# EAGLE board mainboard (EAGLE 4.13), part 1 of 2
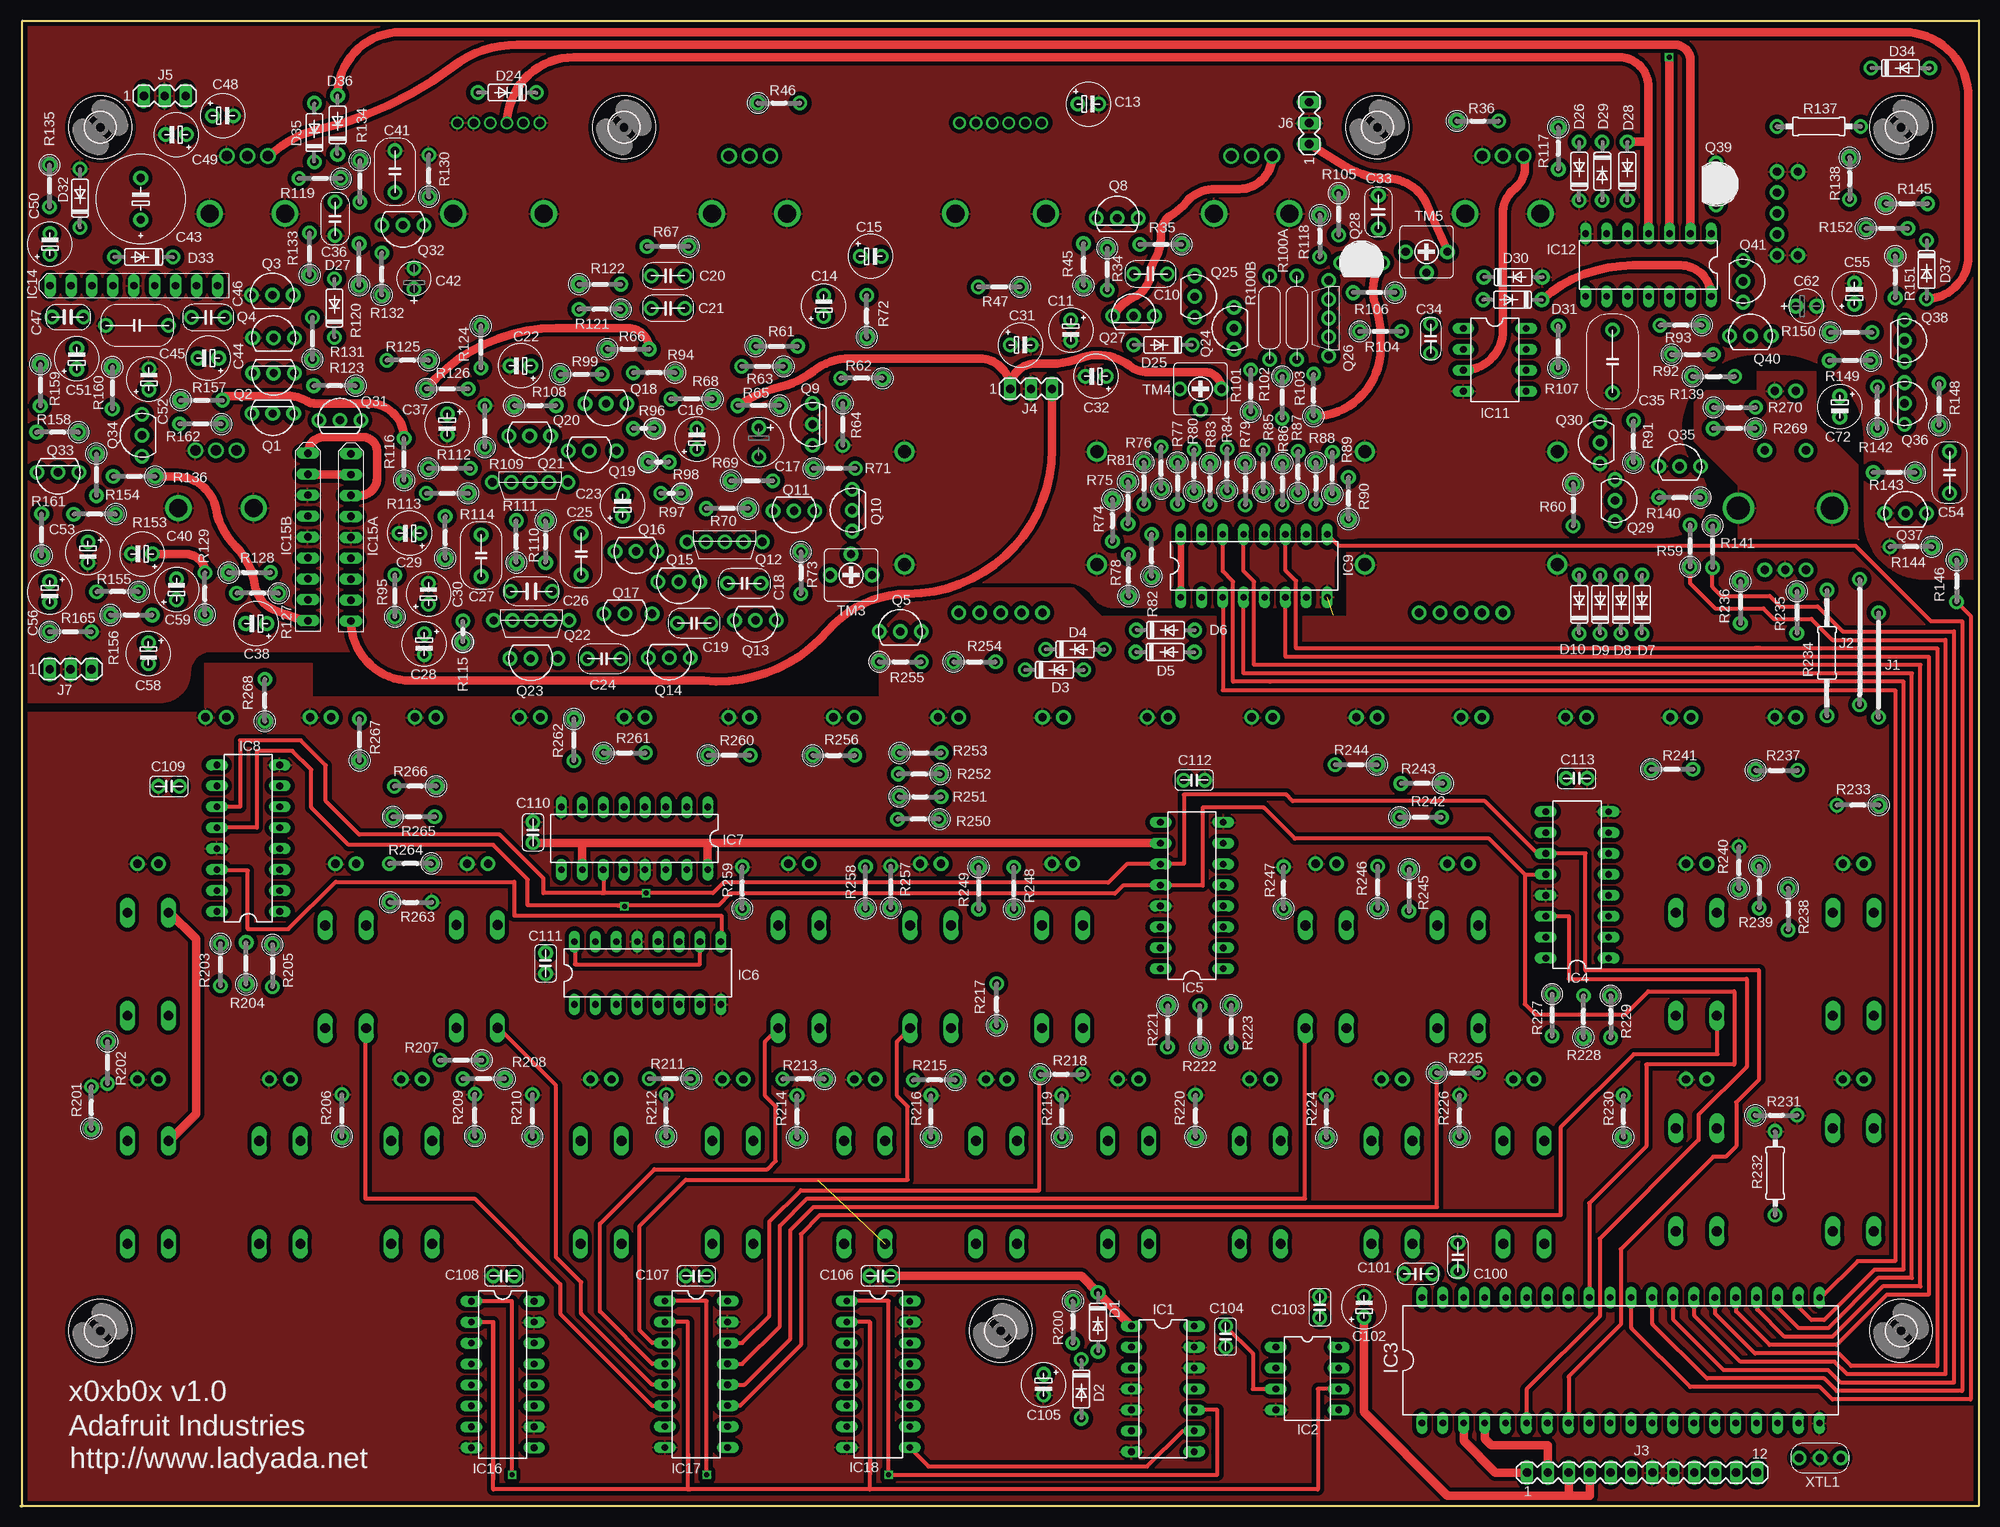
[diagram p2: board, top side]
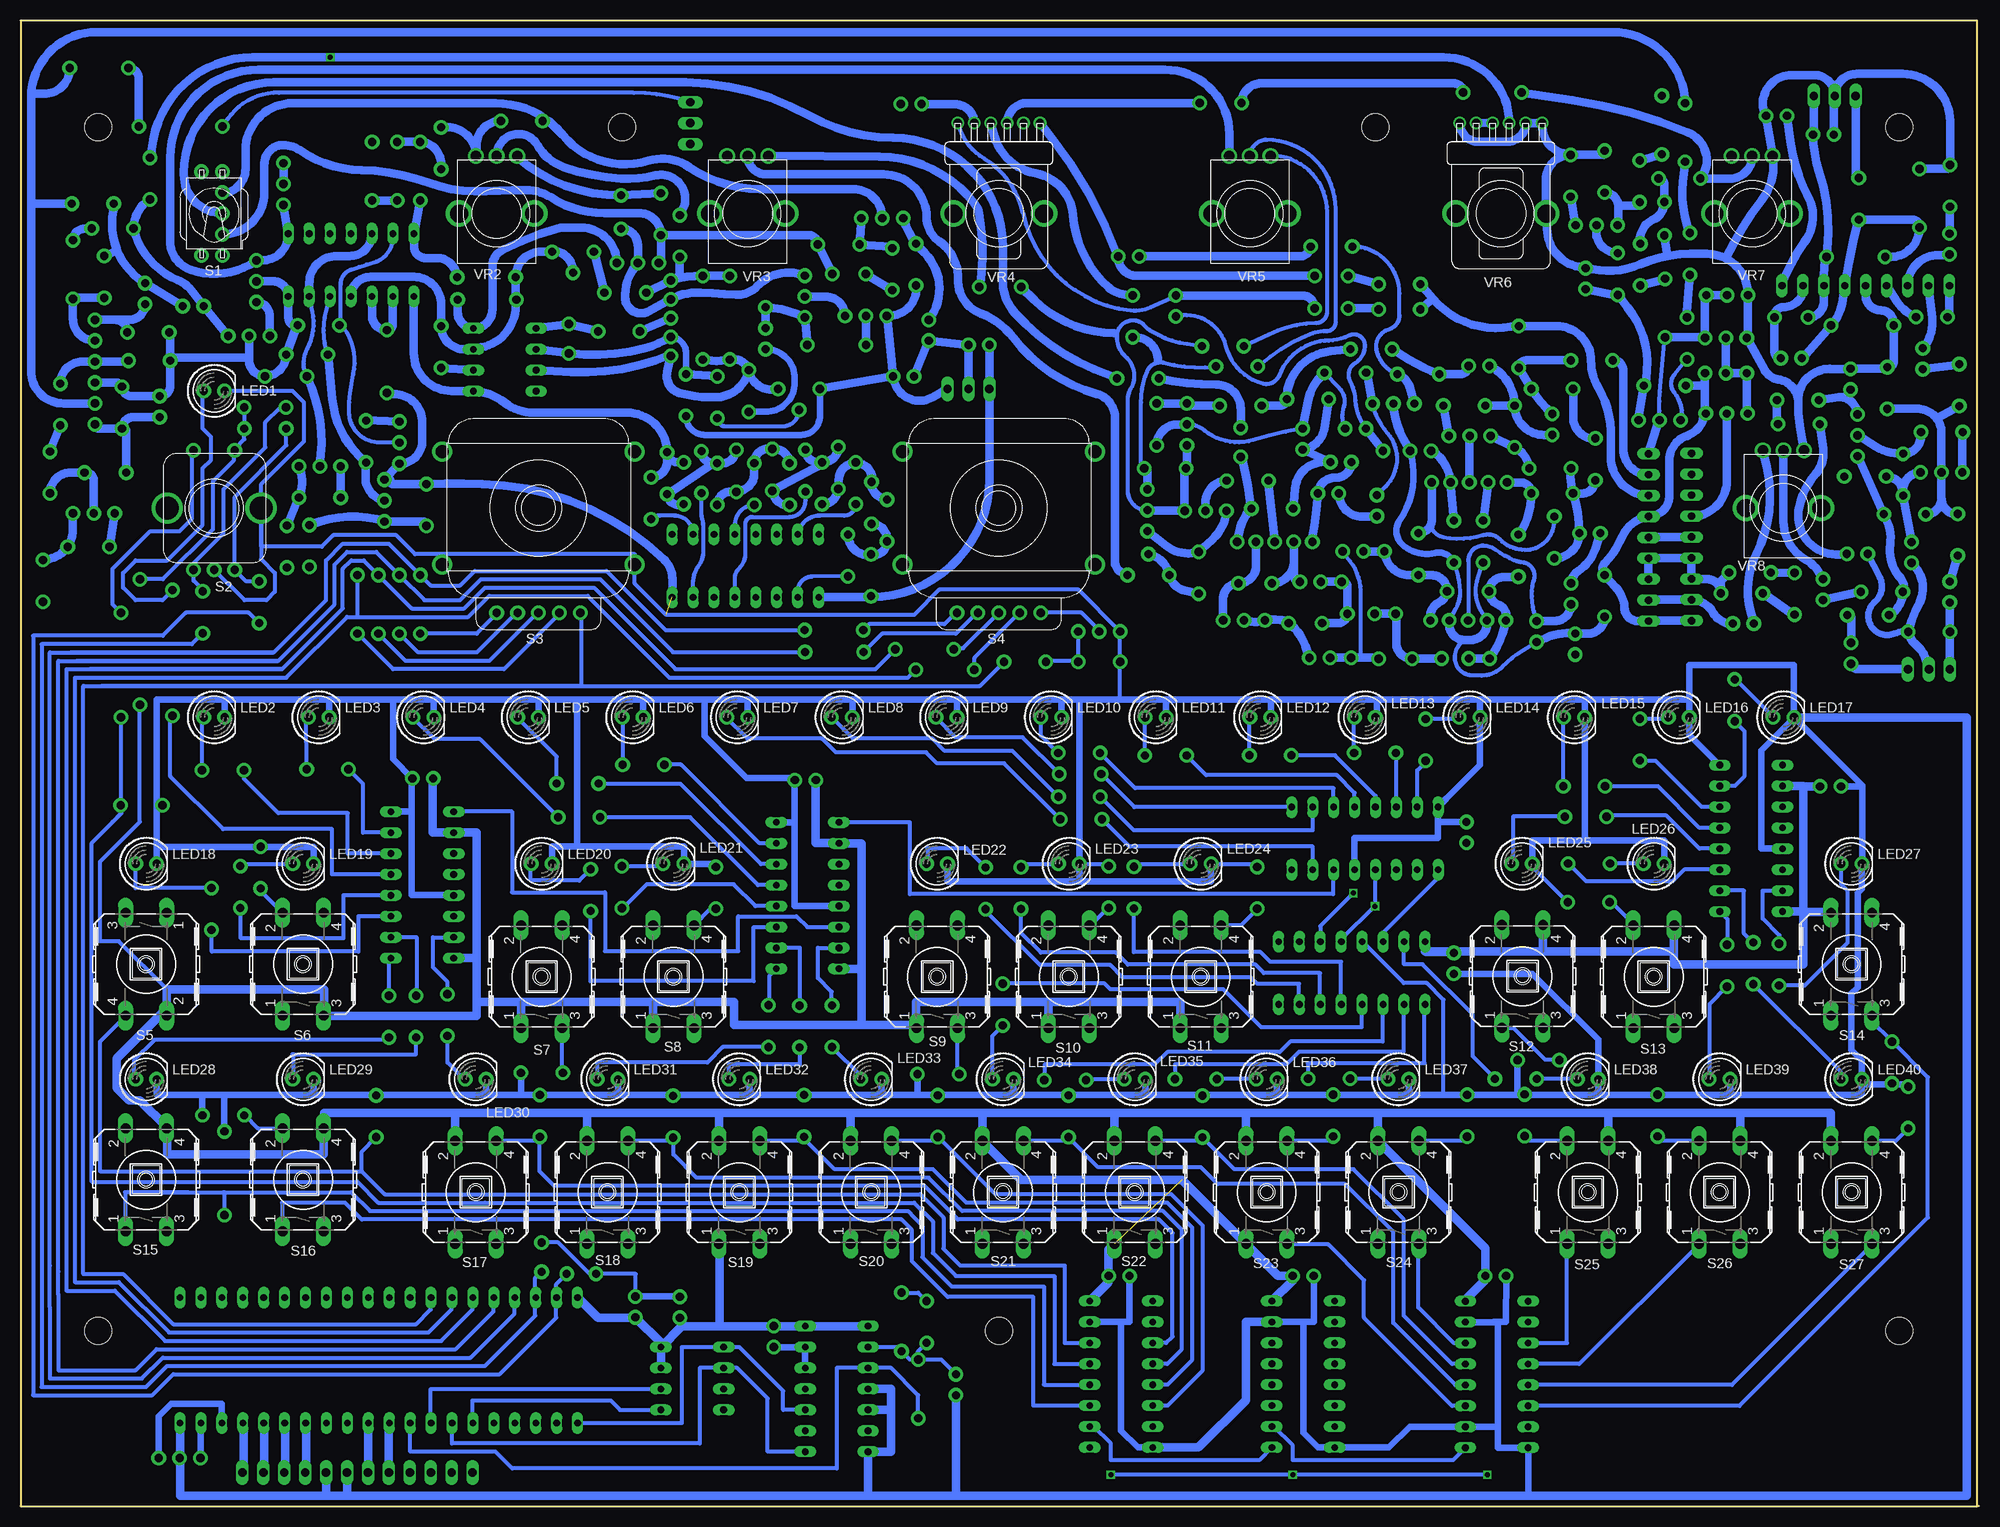
[diagram p3: board, bottom side, seen from below]

Size 237.72 x 180.34 mm. Coordinates in mm from the lower left corner, seen from the top.
Outline: 0.23,0 0.23,180.34 237.72,180.34 237.72,0 0.2,0
Outline: 0,0 0.2,0
Outline: 0.2,0 0.2,0.18
Copper layers (1*16): Top 0.035mm / dielectric 1.5mm / Bottom 0.035mm
Design rules "default": minimum track width 10mil, minimum drill 20mil, track to track 10mil, track to pad 10mil, pad to pad 10mil, via to via 10mil, smd to smd 10mil, copper to edge 10mil, drill to drill 10mil, minimum pad ring 10mil, minimum via ring 8mil, stop-mask expansion 4mil, vias tented up to drill 0mil, thermal gap 10mil

## Footprints (pad centres in the part's own frame; a part is rotated, then mirrored left to right if it is on the bottom)
C050-024X044 = drill 1 pad 1.778 round: 1 -2.032,0; 2 2.032,0
E5-6 = drill 1 pad 1.778 round: + -1.27,0; - 1.27,0
E3,5-8 = drill 1 pad 1.778 round: + -1.778,0; - 1.778,0
C050-025X075 = drill 1 pad 1.778 round: 1 -2.032,0; 2 2.032,0
C050-030X075 = drill 1 pad 1.778 round: 1 -2.54,0; 2 2.54,0
C075-032X103 = drill 1 pad 1.778 round: 1 -2.54,0; 2 2.54,0
C050-035X075 = drill 1 pad 1.778 round: 1 -1.778,0; 2 1.778,0
C050-045X075 = drill 1 pad 1.778 round: 1 -3.81,0; 2 3.81,0
E2,5-7 = drill 1 pad 1.778 round: + -1.27,0; - 1.27,0
E5-5 = drill 1 pad 1.778 round: + -2.54,0; - 2.54,0
C050-050X075 = drill 1 pad 1.778 round: 1 -3.81,0; 2 3.81,0
C050-075X075 = drill 1 pad 1.778 round: 1 -1.905,0; 2 1.905,0
C050-055X075 = drill 1 pad 1.778 round: 1 -2.54,0; 2 2.54,0
C050H075X075 = drill 1 pad 1.778 round: 1 -1.27,0; 2 1.27,0
DO35-10 = drill 1 pad 1.778 round: A 3.556,0; C -3.556,0
DIL14 = drill 0.813 long: 1 -7.62,-3.81; 2 -5.08,-3.81; 3 -2.54,-3.81; 4 0,-3.81; 5 2.54,-3.81; 6 5.08,-3.81; 7 7.62,-3.81; 8 7.62,3.81; 9 5.08,3.81; 10 2.54,3.81; 11 0,3.81; 12 -2.54,3.81; 13 -5.08,3.81; 14 -7.62,3.81
DIL08 = drill 0.813 long: 1 -3.81,-3.81; 2 -1.27,-3.81; 3 1.27,-3.81; 4 3.81,-3.81; 5 3.81,3.81; 6 1.27,3.81; 7 -1.27,3.81; 8 -3.81,3.81
DIL40 = drill 0.813 long: 1 -24.13,-7.62; 2 -21.59,-7.62; 3 -19.05,-7.62; 4 -16.51,-7.62; 5 -13.97,-7.62; 6 -11.43,-7.62; 7 -8.89,-7.62; 8 -6.35,-7.62; 9 -3.81,-7.62; 10 -1.27,-7.62; 11 1.27,-7.62; 12 3.81,-7.62; 13 6.35,-7.62; 14 8.89,-7.62; 15 11.43,-7.62; 16 13.97,-7.62; 17 16.51,-7.62; 18 19.05,-7.62; 19 21.59,-7.62; 20 24.13,-7.62; 21 24.13,7.62; 22 21.59,7.62; 23 19.05,7.62; 24 16.51,7.62; 25 13.97,7.62; 26 11.43,7.62; 27 8.89,7.62; 28 6.35,7.62; 29 3.81,7.62; 30 1.27,7.62; 31 -1.27,7.62; 32 -3.81,7.62; 33 -6.35,7.62; 34 -8.89,7.62; 35 -11.43,7.62; 36 -13.97,7.62; 37 -16.51,7.62; 38 -19.05,7.62; 39 -21.59,7.62; 40 -24.13,7.62
DIL16 = drill 0.813 long: 1 -8.89,-3.81; 2 -6.35,-3.81; 3 -3.81,-3.81; 4 -1.27,-3.81; 5 1.27,-3.81; 6 3.81,-3.81; 7 6.35,-3.81; 8 8.89,-3.81; 9 8.89,3.81; 10 6.35,3.81; 11 3.81,3.81; 12 1.27,3.81; 13 -1.27,3.81; 14 -3.81,3.81; 15 -6.35,3.81; 16 -8.89,3.81
SIP9 = drill 0.9 pad 1.016 long: 1 -10.16,0; 2 -7.62,0; 3 -5.08,0; 4 -2.54,0; 5 0,0; 6 2.54,0; 7 5.08,0; 8 7.62,0; 9 10.16,0
12 = drill 1 pad 1.778 round: 1 -6.35,0; 2 6.35,0
15 = drill 1 pad 1.778 round: 1 -7.62,0; 2 7.62,0
MA12-1 = drill 1.016 long: 1 -13.97,0; 2 -11.43,0; 3 -8.89,0; 4 -6.35,0; 5 -3.81,0; 6 -1.27,0; 7 1.27,0; 8 3.81,0; 9 6.35,0; 10 8.89,0; 11 11.43,0; 12 13.97,0
MA03-1 = drill 1.016 long: 1 -2.54,0; 2 0,0; 3 2.54,0
LED5MM = drill 1 pad 1.778 round: A -1.27,0; K 1.27,0
TO92 = drill 1 pad 1.778 round: 1 2.54,0; 2 0,0; 3 -2.54,0
2SC536F = drill 1 pad 1.778 round: 1 2.54,0; 2 0,0; 3 -2.54,0
SSIP5 = drill 1 pad 1.778 round: 1 -4.572,0; 2 -2.286,0; 3 0,0; 4 2.286,0; 5 4.572,0
2SC536_UNEVEN = drill 1 pad 1.778 round: 1 2.54,0; 2 0,0; 3 -3.302,0
2SK30 = drill 1 pad 1.778 round: 1 2.54,0; 2 0,0; 3 -2.54,0
0207/5V = drill 1 pad 1.778 round: 1 -2.54,0; 2 2.54,0
0207/2V = drill 1 pad 1.778 round: 1 -1.27,0; 2 1.27,0
R-7,5 = drill 1 pad 1.778 round: 1 -5.08,0; 2 5.08,0
0207/10 = drill 1 pad 1.778 round: 1 -5.08,0; 2 5.08,0
0207/15 = drill 1 pad 1.778 round: 1 -7.62,0; 2 7.62,0
NKKTOGGLE = drill 1 pad 1.778 round: 1 -1.016,2.54; 2 -1.016,0; 3 -1.016,-2.54; M1 -1.016,-5.08; M2 1.524,-5.08; M3 1.524,5.08; M4 -1.016,5.08
PEC11-S = drill 1 pad 1.778 round: A -2.5,-7.5; B 2.5,-7.5; C 0,-7.5; SW1 -2.5,7; SW2 2.5,7 | drill 2.8 round: P$1 5.7,0; P$2 -5.7,0
GH3074 = drill 1 pad 1.778 round: C 5.08,-12.7; P$1 2.54,-12.7; P$2 0,-12.7; P$4 -2.54,-12.7; P$8 -5.08,-12.7 | drill 1.6 round: MT1 -11.684,6.858; MT2 -11.684,-6.858; MT3 11.684,-6.858; MT4 11.684,6.858
B3F-40XX = drill 1.194 long: 1 -6.248,2.489; 2 6.248,2.489; 3 -6.248,-2.489; 4 6.248,-2.489
306 = drill 1 pad 1.778 round: 1 -2.54,0; 2 0,-2.54; 3 2.54,0
1,3 = hole 3.302: 0,0
EVU = drill 1.27 round: 1 -2.5,-7; 2 0,-7; 3 2.5,-7 | drill 2.184 round: M1 -4.572,0; M2 4.572,0
ALPHADUAL = drill 1.016 round: 1A -3,-11; 1B -1,-11; 2A -5,-11; 2B 1,-11; 3A 5,-11; 3B 3,-11 | drill 2.184 round: M1 -5.5,0; M2 5.5,0
2SC2021 = drill 1 pad 1.778 round: 1 -2.54,0; 2 0,0; 3 2.54,0

## Placement (x,y rotation side)
C10  .01  [C050-024X044]  137.16,149.58 180 top
C11  1/50  [E5-6]  127.48,142.75 270 top
C13  1/50  [E5-6]  129.62,170.21 0 top
C14  1/50  [E5-6]  97.49,145.69 90 top
C15  1/50  [E5-6]  103.2,151.71 0 top
C16  10/16  [E5-6]  82.09,129.54 90 top
C17  1/50  [E3,5-8]  89.61,129.16 270 top
C18  .018  [C050-025X075]  87.86,112.01 0 top
C19  .033  [C050-025X075]  81.76,107.19 180 top
C20  .01  [C050-024X044]  78.59,149.35 0 top
C21  .01  [C050-024X044]  78.59,145.41 0 top
C22  1/50  [E5-6]  60.68,138.43 180 top
C23  1/50  [E5-6]  73.08,121.46 90 top
C24  .033  [C050-025X075]  70.84,102.87 180 top
C25  .1  [C050-030X075]  68.05,115.57 90 top
C26  .033  [C075-032X103]  62,111.05 180 top
C27  .1  [C050-030X075]  55.91,115.39 90 top
C28  47/16  [E5-6]  49,104.65 270 top
C29  1/50  [E5-6]  47.22,118.11 180 top
C30  10/16  [E5-6]  49.5,110.74 90 top
C31  10/16  [E5-6]  121.39,140.97 0 top
C32  10/16  [E5-6]  130.53,137.16 180 top
C33  .01  [C050-024X044]  164.82,157.1 90 top
C34  .001  [C050-035X075]  171.17,141.73 270 top
C35  .22  [C050-045X075]  193.24,138.96 270 top
C36  .033  [C050-025X075]  38.18,156.29 270 top
C37  10/16  [E5-6]  51.79,131.32 270 top
C38  1/50  [E5-6]  28.6,107.14 180 top
C40  10/16  [E5-6]  14.76,115.6 180 top
C41  .1  [C050-030X075]  45.44,162 90 top
C42  1/35  [E2,5-7]  47.75,149.02 90 top
C43  1000/6.3  [E5-5]  14.58,158.7 90 top
C44  47/16  [E5-6]  22.78,139.37 180 top
C45  .068  [C050-050X075]  14.15,143.33 180 top
C46  .01  [C050-024X044]  22.78,144.3 0 top
C47  .0068  [C050-075X075]  5.71,144.35 180 top
C48  100/6.3  [E5-6]  24.56,168.78 0 top
C49  100/6.3  [E5-6]  18.87,166.5 180 top
C50  10/16  [E5-6]  3.56,153.21 90 top
C51  2.2/50  [E5-6]  6.81,139.29 90 top
C52  10/16  [E5-6]  15.57,136.8 90 top
C53  47/16  [E5-6]  8.18,115.77 270 top
C54  .047  [C050-055X075]  234.16,125.48 270 top
C55  47/16  [E5-6]  222.61,147.19 90 top
C56  1/50  [E5-6]  3.53,110.97 270 top
C58  1/50  [E5-6]  15.52,103.53 270 top
C59  1/50  [E5-6]  18.92,111.28 90 top
C62  1/35  [E2,5-7]  216.76,145.67 0 top
C72  10/16  [E5-6]  220.83,133.48 270 top
C100  .001  [C050-035X075]  174.47,30.23 270 top
C101  .001  [C050-035X075]  169.65,28.19 0 top
C102  100/10  [E5-6]  163.09,24.18 90 top
C103  .1  [C050H075X075]  157.71,24.13 90 top
C104  .1  [C050H075X075]  146.28,20.57 90 top
C105  1/50  [E5-6]  124.18,14.73 270 top
C106  .1  [C050H075X075]  104.37,27.94 0 top
C107  .1  [C050H075X075]  82.02,27.94 0 top
C108  .1  [C050H075X075]  58.65,27.94 0 top
C109  .1  [C050H075X075]  18.01,87.38 0 top
C110  .1  [C050H075X075]  62.2,81.79 270 top
C111  .1  [C050H075X075]  63.73,65.89 90 top
C112  .1  [C050H075X075]  142.47,88.14 180 top
C113  .1  [C050H075X075]  188.9,88.34 180 top
D1  1N4148  [DO35-10]  130.78,22.35 270 top
D2  1N4148  [DO35-10]  128.75,14.22 270 top
D3  1N4148  [DO35-10]  125.5,101.52 0 top
D4  1N4148  [DO35-10]  127.99,104.01 0 top
D5  1N4148  [DO35-10]  138.94,103.68 0 top
D6  1N4148  [DO35-10]  138.99,106.35 0 top
D7  1N4148  [DO35-10]  196.82,109.47 90 top
D8  1N4148  [DO35-10]  194.28,109.47 90 top
D9  1N4148  [DO35-10]  191.74,109.47 90 top
D10  1N4148  [DO35-10]  189.2,109.47 90 top
D24  1N4148  [DO35-10]  59.05,171.6 180 top
D25  1N4148  [DO35-10]  138.66,140.97 180 top
D26  1N4148  [DO35-10]  189.2,162.05 90 top
D27  1N4148  [DO35-10]  38.1,145.44 90 top
D28  1N4148  [DO35-10]  195.05,162.05 90 top
D29  1N4148  [DO35-10]  192,162.05 270 top
D30  1N4148  [DO35-10]  181.18,149.2 0 top
D31  1N4148  [DO35-10]  181.1,146.46 180 top
D32  1N4148  [DO35-10]  7.21,158.78 90 top
D33  1N4148  [DO35-10]  14.94,151.64 180 top
D34  1N4148  [DO35-10]  228.19,174.57 0 top
D35  1N4148  [DO35-10]  35.66,166.75 90 top
D36  1N4148  [DO35-10]  38.48,167.67 90 top
D37  1N4148  [DO35-10]  231.37,150.11 270 top
IC1  74126N  [DIL14]  138.66,14.22 270 top
IC2  AT25P  [DIL08]  156.18,15.49 270 top
IC3  MEGA162P  [DIL40]  194.23,17.7 0 top
IC4  74HC595N  [DIL16]  188.95,75.41 90 top
IC5  74HC595N  [DIL16]  142.19,74.12 90 top
IC6  74HC595N  [DIL16]  76.12,64.72 0 top
IC7  74HC595N  [DIL16]  74.52,81.05 180 top
IC8  74HC595N  [DIL16]  27.64,81.08 90 top
IC9  4174P  [DIL16]  149.73,114.15 0 top
IC11  [DIL08]  178.94,139.17 270 top
IC12  4066N  [DIL14]  197.61,150.67 180 top
IC14  LA44140  [SIP9]  13.74,148.16 0 top
IC15A  [SIP9]  40.11,117.6 270 top
IC15B  BA6110  [SIP9]  34.87,117.65 270 top
IC16  74HC165N  [DIL16]  58.52,15.98 270 top
IC17  74HC165N  [DIL16]  82.02,16 270 top
IC18  74HC165N  [DIL16]  104.11,16 270 top
J1  J12MM  [12]  225.53,102.11 270 top
J2  J15MM  [15]  223.24,104.9 270 top
J3  [MA12-1]  196.82,4.06 0 top
J4  [MA03-1]  122.66,135.64 0 top
J5  [MA03-1]  17.5,171.2 0 top
J6  [MA03-1]  156.44,167.89 90 top
J7  [MA03-1]  6.07,101.6 0 top
LED1  [LED5MM]  214.22,135.38 0 bottom
LED2  [LED5MM]  214.22,95.76 0 bottom
LED3  [LED5MM]  201.52,95.76 0 bottom
LED4  [LED5MM]  188.82,95.76 0 bottom
LED5  [LED5MM]  176.12,95.76 0 bottom
LED6  [LED5MM]  163.42,95.76 0 bottom
LED7  [LED5MM]  150.72,95.76 0 bottom
LED8  [LED5MM]  138.02,95.76 0 bottom
LED9  [LED5MM]  125.32,95.76 0 bottom
LED10  [LED5MM]  112.62,95.76 0 bottom
LED11  [LED5MM]  99.92,95.76 0 bottom
LED12  [LED5MM]  87.22,95.76 0 bottom
LED13  [LED5MM]  74.52,95.76 0 bottom
LED14  [LED5MM]  61.82,95.76 0 bottom
LED15  [LED5MM]  49.12,95.76 0 bottom
LED16  [LED5MM]  36.42,95.76 0 bottom
LED17  [LED5MM]  23.72,95.76 0 bottom
LED18  [LED5MM]  222.48,77.98 0 bottom
LED19  [LED5MM]  203.43,77.98 0 bottom
LED20  [LED5MM]  174.47,77.98 0 bottom
LED21  [LED5MM]  158.47,77.98 0 bottom
LED22  [LED5MM]  126.47,77.98 0 bottom
LED23  [LED5MM]  110.46,77.98 0 bottom
LED24  [LED5MM]  94.46,77.98 0 bottom
LED25  [LED5MM]  55.47,77.98 0 bottom
LED26  [LED5MM]  39.47,77.98 0 bottom
LED27  [LED5MM]  15.47,77.98 0 bottom
LED28  [LED5MM]  222.48,51.82 0 bottom
LED29  [LED5MM]  203.43,51.82 0 bottom
LED30  [LED5MM]  182.47,51.82 0 bottom
LED31  [LED5MM]  166.47,51.82 0 bottom
LED32  [LED5MM]  150.47,51.82 0 bottom
LED33  [LED5MM]  134.47,51.82 0 bottom
LED34  [LED5MM]  118.47,51.82 0 bottom
LED35  [LED5MM]  102.46,51.82 0 bottom
LED36  [LED5MM]  86.46,51.82 0 bottom
LED37  [LED5MM]  70.46,51.82 0 bottom
LED38  [LED5MM]  47.47,51.82 0 bottom
LED39  [LED5MM]  31.47,51.82 0 bottom
LED40  [LED5MM]  15.47,51.82 0 bottom
Q1  2SA733P  [TO92]  30.61,132.64 180 top
Q2  2SA733P  [TO92]  30.71,137.54 180 top
Q3  2SC536F  [2SC536F]  30.56,147.02 0 top
Q4  2SC536F  [2SC536F]  30.71,141.83 0 top
Q5  2SC536F  [2SC536F]  106.78,106.17 0 top
Q8  2SA733P  [TO92]  133.12,156.36 0 top
Q9  2SA733P  [TO92]  96.14,131.32 90 top
Q10  2SA733P  [TO92]  100.94,120.9 90 top
Q11  2SC536F  [2SC536F]  93.88,120.83 180 top
Q12  2SC1583  [SSIP5]  85.47,117.07 180 top
Q13  2SC536F  [2SC536F]  89.2,107.54 180 top
Q14  2SC536F  [2SC536F]  78.74,102.97 180 top
Q15  2SC536F  [2SC536F]  79.88,112.22 180 top
Q16  2SC536F  [2SC536F]  74.7,115.9 180 top
Q17  2SC536F  [2SC536_UNEVEN]  73.36,108.33 180 top
Q18  2SC536F  [2SC536F]  71.07,133.83 180 top
Q19  2SC536FUNEVEN  [2SC536_UNEVEN]  69.04,128.12 180 top
Q20  2SC536F  [2SC536F]  61.8,129.92 180 top
Q21  2SC1583  [SSIP5]  61.85,124.28 180 top
Q22  2SC2291  [SSIP5]  62,107.52 180 top
Q23  2SC536F  [2SC536_UNEVEN]  61.93,102.9 180 top
Q24  2SC536F  [2SC536F]  147.29,143 90 top
Q25  2SC536F  [2SC536F]  142.52,146.84 270 top
Q26  2SC1583  [SSIP5]  158.8,144.22 90 top
Q27  2SA733P  [TO92]  135.1,144.5 0 top
Q28  2SK30  [2SK30]  162.79,150.93 0 top
Q29  2SC536F  [2SC536F]  193.55,122.07 270 top
Q30  2SC536F  [2SC536F]  191.74,129.11 90 top
Q31  2SA733P  [TO92]  38.76,131.83 0 top
Q32  2SC536F  [2SC536F]  46.41,155.5 180 top
Q33  2SA733P  [TO92]  4.55,125.5 180 top
Q34  2SC536F  [2SC536F]  14.73,130 90 top
Q35  2SC536F  [2SC536F]  201.4,126.24 0 top
Q36  2SA733P  [TO92]  228.7,133.86 270 top
Q37  2SC536F  [2SC536F]  228.83,120.52 0 top
Q38  2SA733P  [TO92]  228.7,141.48 270 top
Q39  2SK30  [2SK30]  205.82,160.5 270 top
Q40  2SC536F  [2SC536F]  209.98,142.06 0 top
Q41  2SC536F  [2SC536F]  209.09,148.69 270 top
R34  10K  [0207/5V]  131.9,150.16 270 top
R35  100K  [0207/5V]  138.4,153.16 180 top
R36  10K  [0207/5V]  176.89,168.15 0 top
R45  22K  [0207/5V]  129.03,150.72 90 top
R46  47K  [0207/5V]  92.05,170.33 0 top
R47  10K  [0207/5V]  118.8,148.01 180 top
R59  100K  [0207/5V]  202.67,116.56 90 top
R60  22K  [0207/5V]  188.47,121.54 270 top
R61  10K  [0207/5V]  91.77,140.82 0 top
R62  220K  [0207/5V]  102.08,136.91 180 top
R63  220K  [0207/5V]  90.07,138.35 180 top
R64  10K  [0207/5V]  99.8,131.32 270 top
R65  10K  [0207/5V]  89.61,133.6 180 top
R66  100K  [0207/5V]  73.76,140.46 0 top
R67  2.2K  [0207/5V]  78.59,152.91 180 top
R68  2.2K  [0207/5V]  81.46,134.39 180 top
R69  2.2K  [0207/5V]  88.77,124.49 0 top
R70  2.2K  [0207/5V]  85.78,121.11 180 top
R71  2.2K  [0207/5V]  98.78,125.98 0 top
R72  100K  [0207/5V]  102.72,144.45 90 top
R73  100K  [0207/5V]  94.72,113.31 270 top
R74  200K  [0207/5V]  132.54,119.66 270 top
R75  200K  [0207/5V]  134.42,121.79 270 top
R76  200K  [0207/5V]  138.46,126.03 90 top
R77  200K  [0207/5V]  140.44,124.18 270 top
R78  200K  [0207/5V]  134.49,113 90 top
R79  200K  [0207/5V]  148.67,124.08 270 top
R80  200K  [0207/5V]  142.44,125.7 90 top
R81  200K  [0207/5V]  136.35,124.18 270 top
R82  200K  [0207/5V]  137.29,115.42 90 top
R83  200K  [0207/5V]  144.37,124.08 270 top
R84  200K  [0207/5V]  146.46,125.81 90 top
R85  200K  [0207/5V]  150.85,125.68 90 top
R86  200K  [0207/5V]  153.16,124.08 270 top
R87  200K  [0207/5V]  155.07,125.53 90 top
R88  200K  [0207/5V]  157.23,124.18 270 top
R89  200K  [0207/5V]  159.23,125.4 90 top
R90  200k  [0207/5V]  161.19,122.35 90 top
R91  1M  [0207/5V]  195.78,129.24 90 top
R92  100K  [0207/5V]  202.95,139.8 0 top
R93  100K  [0207/5V]  201.55,143.36 180 top
R94  10K  [0207/5V]  76.91,137.59 180 top
R95  100  [0207/5V]  45.44,110.49 90 top
R96  10K  [0207/2V]  75.67,130.81 180 top
R97  10K  [0207/2V]  78.97,122.94 180 top
R98  2.2K  [0207/2V]  77.44,126.75 0 top
R99  100K  [0207/5V]  68.05,137.41 0 top
R100A  THERMISTOR-7,5  [R-7,5]  154.91,144.27 270 top
R100B  THERMISTOR-7,5  [R-7,5]  151.61,144.27 90 top
R101  10K  [0207/5V]  149.33,135.38 90 top
R102  100K  [0207/5V]  153.14,134.62 270 top
R103  220k  [0207/5V]  156.95,134.87 90 top
R104  2.2K  [0207/5V]  165.07,142.62 0 top
R105  10K  [0207/5V]  159.99,156.84 270 top
R106  27K  [0207/5V]  164.31,147.32 180 top
R107  2.2K  [0207/5V]  186.66,140.72 90 top
R108  2.2K  [0207/5V]  62.46,133.6 0 top
R109  10K  [0207/5V]  56.36,131.06 90 top
R110  22K  [0207/5V]  63.73,117.09 270 top
R111  22K  [0207/5V]  60.17,117.09 90 top
R112  10K  [0207/5V]  52.04,125.98 0 top
R113  100K  [0207/5V]  51.79,122.94 180 top
R114  100K  [0207/5V]  51.54,117.6 90 top
R115  10K  [0207/2V]  53.7,106.17 90 top
R116  10K  [0207/5V]  46.56,127.08 90 top
R117  22K  [0207/5V]  186.66,164.85 270 top
R118  100K  [0207/5V]  157.71,154.18 270 top
R119  47K  [0207/5V]  36.35,161.16 180 top
R120  22k  [0207/5V]  41.1,150.72 90 top
R121  220K  [0207/5V]  70.33,145.29 180 top
R122  100K  [0207/5V]  70.33,148.34 0 top
R123  1.5M  [0207/5V]  38.13,136.02 180 top
R124  2.2K  [0207/5V]  55.85,140.72 270 top
R125  2.2K  [0207/5V]  46.99,139.09 180 top
R126  2.2K  [0207/5V]  51.79,135.64 0 top
R127  47K  [0207/5V]  28.78,110.82 180 top
R128  220K  [0207/5V]  27.79,113.33 0 top
R129  22K  [0207/5V]  22.38,110.77 90 top
R130  100  [0207/5V]  49.56,161.49 90 top
R131  220K  [0207/5V]  35.43,141.76 90 top
R132  100  [0207/5V]  43.84,149.58 90 top
R133  2.2K  [0207/5V]  35.08,152.02 90 top
R134  22K  [0207/5V]  41.17,160.83 270 top
R135  4.7k  [0207/5V]  3.51,160.27 270 top
R136  100  [0207/5V]  13.79,124.99 180 top
R137  1K  [0207/10]  218.29,167.49 180 top
R138  68K  [0207/5V]  222.02,161.16 270 top
R139  100K  [0207/5V]  205.51,137.13 0 top
R140  100K  [0207/5V]  201.4,122.43 180 top
R141  100K  [0207/5V]  205.38,116.48 270 top
R142  10K  [0207/5V]  225.4,133.35 90 top
R143  10K  [0207/5V]  227.43,125.48 180 top
R144  10K  [0207/5V]  229.46,116.46 180 top
R145  10K  [0207/5V]  228.96,158.12 0 top
R146  22K  [0207/5V]  235,112.32 270 top
R148  10K  [0207/5V]  232.89,133.73 90 top
R149  10K  [0207/5V]  222.1,139.06 180 top
R150  22  [0207/5V]  222.22,142.49 0 top
R151  22K  [0207/5V]  227.56,149.22 270 top
R152  100  [0207/5V]  226.54,155.12 0 top
R153  100k  [0207/5V]  8.99,120.42 180 top
R154  100K  [0207/5V]  9.19,125.22 270 top
R155  47K  [0207/5V]  11.79,111 180 top
R156  100K  [0207/5V]  13.44,108.18 0 top
R157  10k  [0207/5V]  21.97,134.26 0 top
R158  10k  [0207/5V]  4.5,130.38 180 top
R159  33K  [0207/5V]  2.39,136.09 270 top
R160  10k  [0207/5V]  11.13,135.74 270 top
R161  1K  [0207/5V]  2.57,117.93 90 top
R162  2.2K  [0207/5V]  21.84,131.37 180 top
R165  100K  [0207/5V]  6.05,106.15 0 top
R200  1M  [0207/5V]  127.74,22.35 270 top
R201  10K  [0207/5V]  8.59,48.39 90 top
R202  10K  [0207/5V]  10.54,53.85 270 top
R203  10K  [0207/5V]  24.26,65.74 270 top
R204  10K  [0207/5V]  27.38,65.89 90 top
R205  10K  [0207/5V]  30.58,65.61 270 top
R206  10K  [0207/5V]  39.01,47.42 90 top
R207  10K  [0207/5V]  53.47,54.13 180 top
R208  10K  [0207/5V]  56.21,51.87 180 top
R209  10K  [0207/5V]  55.14,47.45 90 top
R210  10K  [0207/5V]  62.13,47.4 90 top
R211  10K  [0207/5V]  78.87,51.89 180 top
R212  10K  [0207/5V]  78.38,47.42 90 top
R213  10K  [0207/5V]  95.05,51.84 180 top
R214  10K  [0207/5V]  94.26,47.29 90 top
R215  10K  [0207/5V]  110.92,51.71 180 top
R216  10K  [0207/5V]  110.52,47.32 90 top
R217  10K  [0207/5V]  118.49,60.88 90 top
R218  10K  [0207/5V]  126.31,52.43 0 top
R219  10K  [0207/5V]  126.39,47.32 90 top
R220  10K  [0207/5V]  142.62,47.37 90 top
R221  10K  [0207/5V]  139.22,58.24 270 top
R222  10K  [0207/5V]  143.15,58.22 90 top
R223  10K  [0207/5V]  146.94,58.27 270 top
R224  10K  [0207/5V]  158.52,47.27 90 top
R225  10K  [0207/5V]  174.45,52.6 0 top
R226  10K  [0207/5V]  174.68,47.37 90 top
R227  10K  [0207/5V]  185.9,59.61 270 top
R228  10K  [0207/5V]  189.71,59.44 90 top
R229  10K  [0207/5V]  193.01,59.44 270 top
R230  10K  [0207/5V]  194.56,47.32 90 top
R231  10K  [0207/5V]  213.11,47.45 0 top
R232  10K  [0207/10]  212.98,40.41 90 top
R233  10K  [0207/5V]  223.04,85.09 180 top
R234  10K  [0207/15]  219.28,103.58 90 top
R235  220k  [0207/5V]  215.62,108.51 270 top
R236  220k  [0207/5V]  208.76,109.73 270 top
R237  10K  [0207/5V]  213.16,89.33 0 top
R238  10K  [0207/5V]  214.55,72.49 270 top
R239  10K  [0207/5V]  211.05,75.16 270 top
R240  10K  [0207/5V]  208.58,77.52 90 top
R241  10K  [0207/5V]  200.46,89.46 0 top
R242  10K  [0207/5V]  169.93,83.64 0 top
R243  10K  [0207/5V]  170.1,87.73 180 top
R244  10K  [0207/5V]  162.1,89.99 180 top
R245  10K  [0207/5V]  168.53,74.78 270 top
R246  10K  [0207/5V]  164.74,75.13 90 top
R247  10K  [0207/5V]  153.31,75.06 90 top
R248  10K  [0207/5V]  120.57,75.01 90 top
R249  10K  [0207/5V]  116.28,75.03 270 top
R250  10K  [0207/5V]  108.99,83.39 180 top
R251  10K  [0207/5V]  109.19,86.11 0 top
R252  10K  [0207/5V]  109.09,88.87 180 top
R253  10K  [0207/5V]  109.22,91.44 0 top
R254  10K  [0207/5V]  115.8,102.49 0 top
R255  10K  [0207/5V]  106.78,102.49 0 top
R256  10K  [0207/5V]  98.7,91.14 0 top
R257  10K  [0207/5V]  105.64,75.16 90 top
R258  10K  [0207/5V]  102.57,75.08 90 top
R259  10K  [0207/5V]  87.6,75.06 90 top
R260  10K  [0207/5V]  86,91.16 0 top
R261  10K  [0207/5V]  73.3,91.44 0 top
R262  10K  [0207/5V]  67.16,93.01 270 top
R263  10K  [0207/5V]  47.37,73.3 0 top
R264  10K  [0207/5V]  47.32,78 180 top
R265  10K  [0207/5V]  47.73,83.69 0 top
R266  10K  [0207/5V]  47.9,87.4 180 top
R267  10K  [0207/5V]  41.15,93.04 90 top
R268  10K  [0207/5V]  29.64,97.82 90 top
R269  10K  [0207/5V]  208.03,130.81 180 top
R270  10K  [0207/5V]  208.05,133.38 0 top
S1  SWITCH_GND  [NKKTOGGLE]  214.22,156.92 180 bottom
S2  PEC11-S  [PEC11-S]  214.22,121.16 0 bottom
S3  GH3074  [GH3074]  174.85,121.16 0 bottom
S4  GH3074  [GH3074]  118.97,121.16 0 bottom
S5  [B3F-40XX]  222.48,65.79 270 bottom
S6  [B3F-40XX]  203.43,65.79 90 bottom
S7  [B3F-40XX]  174.47,64.26 90 bottom
S8  [B3F-40XX]  158.47,64.26 90 bottom
S9  [B3F-40XX]  126.47,64.26 90 bottom
S10  [B3F-40XX]  110.46,64.26 90 bottom
S11  [B3F-40XX]  94.46,64.26 90 bottom
S12  [B3F-40XX]  55.4,64.31 90 bottom
S13  [B3F-40XX]  39.47,64.26 90 bottom
S14  [B3F-40XX]  15.47,65.79 90 bottom
S15  [B3F-40XX]  222.48,39.62 90 bottom
S16  [B3F-40XX]  203.43,39.62 90 bottom
S17  [B3F-40XX]  182.47,38.1 90 bottom
S18  [B3F-40XX]  166.47,38.1 90 bottom
S19  [B3F-40XX]  150.47,38.1 90 bottom
S20  [B3F-40XX]  134.47,38.1 90 bottom
S21  [B3F-40XX]  118.47,38.1 90 bottom
S22  [B3F-40XX]  102.46,38.1 90 bottom
S23  [B3F-40XX]  86.46,38.1 90 bottom
S24  [B3F-40XX]  70.46,38.1 90 bottom
S25  [B3F-40XX]  47.47,38.1 90 bottom
S26  [B3F-40XX]  31.47,38.1 90 bottom
S27  [B3F-40XX]  15.47,38.1 90 bottom
TM3  500K(B)  [306]  100.81,113.03 180 top
TM4  50K(B)  [306]  143.23,135.64 0 top
TM5  5K(B)  [306]  170.66,152.27 0 top
U$2  [1,3]  228.27,21.29 0 top
U$23  [1,3]  228.27,167.39 0 top
U$24  [1,3]  9.68,167.39 0 top
U$25  [1,3]  9.68,21.29 0 top
U$27  [1,3]  118.97,21.29 0 top
U$28  [1,3]  73.25,167.39 0 top
U$29  [1,3]  164.69,167.39 0 top
VR2  50K(B)  [EVU]  179.93,156.92 180 bottom
VR3  50K(A)  [EVU]  149.45,156.92 180 bottom
VR4  50K(B)  [ALPHADUAL]  118.97,156.92 180 bottom
VR5  50K(A)  [EVU]  88.49,156.92 180 bottom
VR6  1M(A)  [ALPHADUAL]  58.01,156.92 180 bottom
VR7  50K(B)  [EVU]  27.53,156.92 180 bottom
VR8  50K(A)  [EVU]  23.72,121.16 180 bottom
XTL1  2SC2021R  [2SC2021]  218.41,5.84 0 top

## Tracks (layer width: path | path; a pad name or v marks a point on that pad's centre or on a via)
+5.333V
  Top 0.762: 140.84,110.29 arc-90 140.79,110.24 arc90 140.84,110.29 | 140.84,110.29 IC9.1 IC9.16
  Top 1.016: TM4.3 arc90 143.74,137.67 136.88,137.67 arc-40 134.59,138.43 arc60 128.5,139.32 arc-22 125.2,138.68 123.16,138.68 arc90 J4.1 arc90 116.43,139.32 100.69,139.32 arc38 96.24,137.79 arc-24 92.3,135.89 arc20 87.1,133.6 R65.2 | IC11.3 arc90 179.93,142.7 179.93,156.97 arc-51 181.33,159.89 arc74 182.35,163.96 VR2.3 | R66.2 arc90 73.76,143 65,143 arc50 R126.1 | R116.2 arc90 42.32,133.86 35.92,133.86 arc-31 34.52,134.24 arc38 31.98,134.75 24.99,134.75 arc90 24.49,134.24 arc90 R157.2
  Bottom 0.508: IC9.1 140.84,110.44
  Bottom 0.762: 140.92,110.36 IC9.1
  Bottom 1.016: R101.2 arc-82 R100B.1 arc24 R100A.2 | TM4.3 arc97 R101.2 | C31.+ J4.1 120.12,124.71 arc90 134.47,110.36 | R101.2 arc76 153.14,134.62 arc19 157.71,135.13 arc87 159.23,137.67 Q26.1 158.72,139.83 arc26 170.92,137.67 IC11.3 | R66.2 78.71,140.21 arc-83 84.05,134.37 | 84.05,134.37 R68.1 | R116.2 46.56,129.56 arc90 46.58,129.54 arc90 49.25,132.21 R126.1 | 134.47,110.36 arc90 134.49,110.39 | 134.47,110.36 140.92,110.36 | 134.47,110.36 arc90 134.49,110.39 | 134.49,110.39 R78.1 | R162.1 24.41,131.37 24.51,131.47 R157.2 | 84.05,134.37 arc90 84.81,133.6 R65.2 | R117.1 185.9,167.39 arc90 VR2.3 arc90 182.4,163.96 182.35,163.96 182.35,165.23 arc90 R36.2
+5V  (1 unrouted)
  Top 0.508: IC6.10 82.47,65.79 67.28,65.79 67.28,68.53 | 67.28,68.53 67.28,68.58 | IC6.16 67.28,68.53 | IC2.3 149.58,14.22 149.58,18.54 C104.2
  Top 0.762: 138.56,80.54 138.38,80.54 IC5.10
  Top 1.016: 138.38,80.52 138.4,80.52 | IC5.10 138.38,80.52 | IC7.16 83.41,80.52 84.3,80.52 | 138.38,80.52 84.3,80.52 | 84.3,80.52 68.05,80.52 | 68.05,80.52 C110.2 | IC7.10 68.17,80.52 68.05,80.52 | 18.01,44.3 18.01,44.2 | S27.2 18.01,44.3 | 18.01,44.3 21.31,47.6 21.31,68.83 18.01,72.14 17.96,72.08 S14.2 | IC1.1 D1.C 128.75,27.94 C106.2 | 184.38,1.27 173.2,1.27 163.04,11.43 163.04,22.86 C102.+ | 184.38,1.27 185.39,1.27 | J3.3 187.93,1.27 186.54,1.27 | 184.38,1.27 186.54,1.27 | J3.4 190.47,1.27 186.54,1.27
  Bottom 0.508: J2.2 223.24,83.06 228.07,78.23 228.07,68.58 225.78,68.58 219.94,62.74 | C111.2 63.73,67.06 67.23,67.06 67.23,67.31 | IC1.14 139.93,21.84 | R200.1 128.75,25.91 D1.C
  Bottom 0.762: S16.4 200.94,45.82 200.84,45.82
  Bottom 1.016: 170.15,25.4 170.1,25.4 IC3.40 167.64,22.86 163.04,22.86 | IC2.8 IC2.7 | 200.89,45.87 200.89,45.72 | 200.89,45.87 S16.4 200.94,42.67 219.94,42.67 219.94,45.87 | 188.44,47.75 200.89,47.75 200.89,45.87 | 188.44,47.75 166.6,47.75 | 166.6,47.75 150.6,47.75 | 150.6,47.75 135.61,47.75 | 135.61,47.75 120.12,47.75 | 120.12,47.75 104.37,47.75 | 104.37,47.75 87.86,47.75 | 87.86,47.75 71.86,47.75 | 71.86,47.75 44.42,47.75 | 44.42,47.75 28.42,47.75 | 28.42,47.75 18.01,47.75 | S17.2 184.96,47.75 188.44,47.75 | S18.2 168.96,47.75 166.6,47.75 | S19.2 152.96,47.75 150.6,47.75 | S20.2 136.96,47.75 135.61,47.75 | 120.12,47.75 120.95,47.75 S21.2 121.03,44.35 | S22.2 104.95,47.75 104.37,47.75 | S23.2 88.95,47.75 87.86,47.75 | 71.86,47.75 72.95,47.75 S24.2 59.92,31.32 C108.2 59.97,27.38 62.46,24.89 62.43,24.87 IC16.16 | S25.4 44.98,47.75 44.42,47.75 | S26.4 28.98,47.75 28.42,47.75 | 219.94,45.97 219.94,45.87 | 219.94,45.87 S15.4 219.99,45.92 219.94,45.97 | 219.99,62.74 S5.2 | S6.3 200.89,59.54 | 219.99,62.74 219.94,62.74 200.89,62.74 200.89,59.54 | 160.25,61.21 151.1,61.21 151.1,58.42 135.61,58.42 | 135.61,58.42 129.01,58.42 129.01,58.01 | S11.1 96.95,61.21 111.23,61.21 | 129.01,58.01 129.01,57.91 | 129.01,58.01 S9.1 | 111.23,61.21 129.01,61.21 129.01,58.01 | S10.1 112.95,61.21 111.23,61.21 | S8.1 160.96,61.21 160.25,61.21 | S7.1 176.96,61.21 176,61.21 | 176,61.21 160.25,61.21 | 200.89,59.54 182.35,59.54 | 182.35,59.54 182.35,66.52 | 182.35,59.54 182.35,61.21 176,61.21 | 182.35,66.52 IC4.16 | 185.14,81.79 IC4.10 | 182.35,66.52 182.35,81.79 185.14,81.79 | 187.68,88.34 187.68,88.39 | 187.68,88.34 C113.2 | 185.14,81.79 187.68,81.79 187.68,88.34
  Bottom 1.016: 219.99,62.74 219.99,60.4 226.03,54.36 226.03,50.8 224.51,49.28 223.24,49.28 219.94,45.97 | S13.4 37.06,70.51 37.06,67.31 | 37.06,67.31 37.06,65.79 21.31,65.79 21.31,72.03 | S12.4 52.91,67.31 51.79,67.31 | 37.06,67.31 51.79,67.31 | IC6.16 67.23,67.31 51.79,67.31 | IC5.16 135.61,65.23 135.61,65.02 | 135.61,58.42 135.61,65.02 | 135.61,65.02 135.61,80.47 IC5.10 138.38,80.52 141.2,80.52 C112.2 | IC8.10 21.31,87.43 21.31,87.38 | 21.31,72.03 21.31,87.38 | 21.31,87.38 C109.2 | IC8.16 21.31,72.19 21.31,72.03 | S27.2 18.01,44.35 18.01,47.75 | 18.01,47.75 17.96,47.75 | S14.2 18.01,72.08 18.01,72.14 21.21,72.14 21.31,72.03 | 157.45,21.84 IC2.8 | IC1.1 IC1.14 C104.2 154.66,21.84 | IC17.16 83.29,27.43 C107.2 85.06,27.94 88.98,31.85 | C103.1 157.45,22.86 157.45,21.84 | 163.04,22.86 C102.+ | IC2.8 159.99,19.81 163.04,22.86 | 88.98,31.85 S23.1 | S22.1 105.64,31.17 C106.2 105.64,27.18 IC18.16 | 154.66,21.84 157.45,21.84 | 152.88,31.85 152.88,32 | 152.88,31.85 S19.1 | 154.66,21.84 152.88,21.84 152.88,31.85 | 88.98,31.85 96.75,39.62 116.31,39.62 121.03,44.35 | 121.03,44.35 121.13,44.45
+6V
  Bottom 1.016: C46.1 20.78,144.3 arc-90 20.8,144.27 arc-90 18.82,146.25 IC14.7 arc6 18.64,151.64 D33.C 18.39,152.65 arc-24 19.41,162.05 arc17 20.17,166.5 C49.+ 20.04,166.5 J5.3
+12V
  Top 1.016: J4.3 125.2,128.27 arc-90 107.67,110.74 arc49 98.02,106.3 arc-55 82.91,100.2 47.35,100.2 arc-90 IC15A.9 | R103.1 arc90 165.07,140.46 165.07,142.24 arc20 164.44,145.92 arc-59 165.33,150.88 Q28.1 | VR3.3 arc-90 147.93,159.89 145.01,159.89 arc50 141.45,158.24 arc-18 139.67,156.72 arc62 138.4,154.31 arc-34 137.64,151.26 arc28 137.13,149.61 arc-62 135.23,146.81 arc35 132.56,144.4 Q27.3 | IC12.14 205.23,146.91 arc90 205.21,146.94 arc90 201.52,150.62 195.68,150.62 arc42 184.63,146.43 D31.C | R136.1 19.02,124.97 arc-79 23.72,121.03 arc34 26.14,116.46 arc-37 28.42,111.89 arc58 30.71,108.84 arc12 34.9,107.44 IC15B.9
  Bottom 0.508: 218.16,139.45 R149.2
  Bottom 0.762: R103.1 arc-90 154.66,130.05 142.98,130.05 arc-90 140.69,132.33 TM4.1
  Bottom 1.016: C32.+ 132.05,139.7 Q27.3 arc-90 129.01,147.55 129.01,148.21 | 129.01,148.21 129.01,148.34 | 129.01,148.21 arc90 R45.1 | J4.3 126.97,134.62 arc115 C32.+ | 205.21,146.81 arc90 205.23,146.84 IC12.14 | Q41.2 207.09,148.69 arc90 205.21,146.81 | 204.19,143.26 arc-90 R93.1 204.19,143.26 | 205.21,146.81 205.21,144.27 arc-90 204.19,143.26 | 209.98,139.45 209.98,139.14 arc-90 208,137.16 arc90 208.03,137.13 R139.2 208.1,137.13 arc90 208.13,137.16 arc-90 205.46,139.83 205.46,139.95 arc-90 205.49,139.93 R92.2 204.19,143.26 | 209.98,139.45 Q40.2 | C32.+ TM4.1 | IC15B.9 39.93,107.49 arc-90 40.11,107.31 IC15A.9 41.38,107.44 arc90 43.03,109.09 arc-39 44.04,111.51 R95.2 arc85 45.44,114.43 arc-19 43.28,117.73 arc58 IC15A.4 arc-90 37.57,122.68 37.57,127 arc73 35.41,129.92 35.28,130.05 arc-53 33.5,131.83 33.25,132.59 | Q36.3 225.91,136.4 R142.2 arc-90 224.26,134.75 C72.+ arc-90 219.56,136.02 R149.2 219.56,142.37 R150.1 | 209.98,139.45 218.16,139.45 219.18,139.45 | 165.46,150.88 Q28.1 165.33,150.88 arc-90 169.65,155.19 172.19,155.19 arc-10 179.17,152.53 arc-64 180.44,150.5 180.44,145.29 arc90 IC11.8 arc90 182.73,143 arc90 184.66,144.93 D31.C | 33.25,132.59 33.2,132.59 Q1.3 33.2,132.64 arc-90 33.25,132.59 | 33.25,132.59 33.25,136.02 | 33.25,136.02 Q2.3 | 33.25,136.02 R123.2
ACCENT
  Top 0.508: R141.2 205.38,111.58 206.48,110.49 212.32,110.49 213.59,109.22 218.16,109.22 221.21,106.17 234.67,106.17 234.67,14.99 231.88,14.99 220.95,14.99 219.43,16.51 206.73,16.51 200.63,22.61 200.63,25.38 | 200.63,25.38 200.63,25.4 | 200.63,25.38 IC3.28
C48
  Bottom 1.016: C48.+ 22.83,165.35 arc-21 20.8,159.13 arc65 21.18,153.42 arc-17 23.98,148.08 IC14.9
DINSYNC1
  Bottom 0.762: J3.12 210.79,4.83
  Bottom 1.016: 210.67,10.08 210.67,10.16 | 210.67,10.08 IC3.17 | 210.79,4.83 210.67,4.83 210.67,10.08
DINSYNC2
  Bottom 1.016: 208.13,10.08 208.13,10.16 | 208.13,10.08 IC3.16 | J3.11 208.13,4.06 208.13,10.08
DINSYNC3
  Bottom 0.762: J3.10 205.71,4.83
  Bottom 1.016: 205.59,10.08 205.59,10.16 | 205.59,10.08 IC3.15 | 205.71,4.83 205.59,4.83 205.59,10.08
DINSYNC4
  Bottom 0.762: J3.9 203.17,4.83
  Bottom 1.016: 203.05,10.08 203.05,10.16 | 203.05,10.08 IC3.14 | 203.17,4.83 203.05,4.83 203.05,10.08
GATE
  Top 0.508: 195.55,25.38 195.55,25.4 | 195.55,25.38 IC3.30 | 195.55,25.38 195.55,21.59 202.67,14.48 218.41,14.48 219.94,12.95 236.7,12.95 236.7,108.08 R146.2
GND  (1 unrouted)
  Bottom 0.508: 105.26,97.89 105.26,97.92 104.24,97.92 | 155.98,77.98 155.98,77.88 153.31,77.88 R247.2 | 107.16,97.89 107.16,98.04 104.24,98.04 R255.1 Q5.3 109.32,111.25 126.21,111.25 129.26,108.2 159.36,108.2 163.17,112.01 163.17,115.57 189.84,115.57 192.13,117.86 199.75,117.86 201.14,116.46 208.51,116.46 208.51,119.76 208.52,119.76 | R60.1 188.44,123.95 | R140.2 198.86,122.17 | 221.21,84.07 221.21,85.09 R233.2 | IC3.20 218.41,10.08 XTL1.2 | 138.4,72.9 138.4,72.87 141.58,72.87 | IC16.15 62.31,22.35 61.7,22.35 | C100.1 172.44,32 168.63,28.19 C101.1 163.04,28.19 163.04,25.45 | 163.04,25.45 163.04,25.4 | C102.- 163.04,25.45 | R94.1 77.57,135.64 arc61 77.06,133.48 arc-40 R96.1 | 96.11,131.32 arc39 93.95,130.56 arc-56 88.11,129.41 arc7 82.14,130.81 C16.- | 41.12,150.75 41.12,150.62 37.82,151.76 | 33.38,152.02 30.71,151.51 | 226.03,152.4 224.76,150.37 C55.- | 141.58,72.85 141.58,72.87 | 141.58,72.87 141.58,72.9 | R263.2 54.2,77.6 LED25.K | R259.2 87.99,77.98 LED24.K | R257.2 105.92,77.98 LED23.K | R240.2 205.59,80.06 205.59,80.01 | IC6.13 69.82,63.5 67.03,63.5 65,61.47 65,50.04 67.54,50.04 67.54,49.91 | 208.52,119.76 208.52,114.95 206.86,113.28 206.86,111 207.87,109.98 210.54,109.98 S2.C | 208.52,119.76 S2.P$1 208.51,121.16 208.51,124.08 203.3,129.29 203.3,133.99 204.7,135.38 LED1.K
  Bottom 0.762: LED2.K 212.95,97.89 214.3,97.89 | 59.77,97.89 72.21,97.89 | 46.2,97.89 59.77,97.89 | 36.04,97.89 46.2,97.89 | 36.04,97.89 35.13,97.89 35.13,102.11 22.45,102.11 LED17.K 22.43,95.76 | 72.21,97.89 83.79,97.89 | 83.79,97.89 85.37,97.89 | 85.37,97.89 97.46,97.89 | 97.46,97.89 97.61,97.89 | 97.61,97.89 105.26,97.89 107.16,97.89 109.19,97.89 | 109.19,97.89 110.16,97.89 | 110.16,97.89 110.57,97.89 | 110.57,97.89 122.35,97.89 | 122.35,97.89 123.06,97.89 | 123.06,97.89 136.02,97.89 | 136.02,97.89 148.72,97.89 | 148.72,97.89 161.42,97.89 | 161.42,97.89 170.15,97.89 | 170.15,97.89 174.12,97.89 | 174.12,97.89 186.46,97.89 | 186.46,97.89 192.51,97.89 | 192.51,97.89 193.01,97.89 | 198.6,97.89 214.3,97.89 | LED3.K 200.25,97.89 198.6,97.89 | LED4.K 187.55,97.89 186.46,97.89 | LED5.K 174.85,97.89 174.12,97.89 | LED6.K 162.15,97.89 161.42,97.89 | LED7.K 149.45,97.89 148.72,97.89 | LED8.K 136.75,97.89 136.02,97.89 | 123.06,97.89 124.05,97.89 | 110.57,97.89 111.35,97.89 | 97.61,97.89 97.61,97.84 98.65,97.84 | 85.37,97.89 85.95,97.89 | LED13.K 73.25,95.71 73.08,95.71 73.08,97.89 72.21,97.89 | 59.77,97.89 60.55,97.89 LED14.K 60.55,89.97 64.71,85.81 | 46.2,97.89 47.85,97.89 LED15.K 47.83,95.76 47.83,80.82 47.32,80.82 | 36.04,97.89 35.15,97.89 LED16.K 35.15,93.6 32.23,90.68 | 32.23,90.68 31.42,89.86 | IC8.13 26.44,79.81 26.44,91.75 22.43,95.76 | LED27.K 14.2,77.93 | LED26.K 38.2,80.82 47.32,80.82 | LED25.K 54.2,80.82 47.32,80.82 | LED22.K 125.2,75.84 110.11,75.84 | 110.11,75.84 109.19,75.84 109.19,75.95 | 109.19,97.89 LED23.K 109.19,75.95 | LED24.K 93.19,75.84 110.11,75.84 | 109.19,75.95 109.09,75.95 | LED21.K 157.2,80.06 168.33,80.06 | 168.33,80.06 170.15,80.06 170.15,97.89
  Bottom 0.762: LED20.K 173.2,80.06 168.33,80.06 | 85.95,97.89 LED12.K | 83.79,97.89 85.95,97.89 | 97.46,97.89 97.46,97.84 98.65,97.84 | 98.65,97.84 LED11.K | 110.16,97.89 110.16,97.84 111.35,97.84 LED10.K | 122.35,97.89 122.35,97.84 124.05,97.84 LED9.K | LED21.K 157.25,77.98 | LED21.K 155.98,77.98 153.31,77.98 | 193.01,97.89 198.6,97.89 | 193.01,97.89 192.76,97.89 | 221.21,80.01 221.21,80.16 | 64.71,85.81 65.63,84.89 | IC7.13 75.79,81.1 65.66,81.1 65.66,83.06 | 65.66,83.06 65.66,84.86 65.63,84.84 65.61,84.84 | LED27.K 14.17,78 14.15,78 14.15,87.48 14.38,87.71 | 14.38,87.71 22.43,95.76 | 214.3,97.89 221.21,97.89 221.21,84.07 | 221.21,80.01 LED18.K | 221.21,84.07 221.21,86.11 | 65.66,83.06 C110.1 | 190.22,88.34 190.22,88.39 | 190.22,88.34 C113.1 192.51,90.68 192.51,97.89 | 190.22,84.3 IC4.8 | 190.22,88.34 190.22,84.3 | IC4.13 185.14,74.17 190.22,74.17 190.22,84.3 | IC5.8 143.74,83.01 143.74,83.06 | C112.1 143.74,83.06 | IC5.13 141.58,72.85 143.74,72.85 143.74,83.06 | 161.42,97.89 154.66,97.89 154.66,93.47 149.58,88.39 143.74,88.39 | 65.61,84.84 65.51,84.84 | 65.61,84.84 IC7.8 64.74,85.75 64.74,85.85 64.71,85.81 | 14.38,87.71 14.45,87.71 14.45,87.38 C109.1 | 32.23,90.68 IC8.8 | C104.1 IC1.13 IC1.12 | 104.62,22.35 104.11,22.35 104.11,9.14 102.08,7.11 IC18.8 | 104.62,22.35 IC18.15 | C106.1 103.1,22.35 104.62,22.35 | 82.27,22.35 82.02,22.35 82.02,8.89 80.24,7.11 IC17.8 71.6,7.11 69.09,9.63 IC16.10 58.39,9.63 58.39,9.14 | 82.27,22.35 IC17.15 | C107.1 80.75,22.35 82.27,22.35 | 58.9,22.33 58.65,22.33 | 58.9,22.33 IC16.15 | 54.58,7.11 54.71,7.11 IC16.8 | 58.9,22.33 58.9,22.35 58.39,22.35 | C108.1 57.43,22.35 58.39,22.35 | 58.39,9.14 58.39,7.11
  Bottom 0.762: 58.39,10.41 58.39,9.14 | 58.39,10.41 58.39,22.35 | 157.71,25.45 C102.- | 133.32,1.27 134.85,1.27 | IC16.8 54.71,1.27 53.57,1.27 | IC16.8 58.39,7.09 58.39,10.41 | C40.- 12.04,112.78 arc47 11.91,110.87 arc28 12.67,109.73 arc-160 10.26,105.92 arc28 8.61,106.17 R165.2 | LED19.K 202.16,80.01 205.59,80.01 221.21,80.01 | 221.21,84.07 221.21,80.01 | 14.2,50.04 14.2,49.91 31.22,49.91 | 14.2,50.04 14.2,51.18 | 194.41,49.91 180.19,49.91 | 180.19,49.91 178.79,49.91 | 178.79,49.91 177.9,49.91 | 177.9,49.91 R226.2 164.69,49.91 | 164.69,49.91 160.38,49.91 | 160.38,49.91 150.09,49.91 | 134.34,49.91 R220.2 150.09,49.91 | 134.34,49.91 130.15,49.91 | 130.15,49.91 128.5,49.91 | 128.5,49.91 116.43,49.91 | 116.43,49.91 112.37,49.91 | 112.37,49.91 102.21,49.91 | 102.21,49.91 95.73,49.91 | 95.73,49.91 84.56,49.91 | 84.56,49.91 79.98,49.91 | 79.98,49.91 70.08,49.91 | 70.08,49.91 67.54,49.91 63.73,49.91 | 63.73,49.91 58.52,49.91 | 58.52,49.91 57.38,49.91 | 57.38,49.91 56.49,49.91 | 56.49,49.91 47.09,49.91 | 47.09,49.91 40.36,49.91 | 40.36,49.91 31.22,49.91 | 194.41,49.91 194.56,49.91 R230.2 | LED28.K 221.21,49.91 216.51,49.91 | 214.1,49.91 216.51,49.91 | 214.1,49.91 200.51,49.91 | 200.51,49.91 194.41,49.91 | LED29.K 202.16,49.91 200.51,49.91 | LED31.K 165.2,49.91 164.69,49.91 | R224.2 158.52,49.91 160.38,49.91 | LED32.K 149.2,49.91 150.09,49.91 | LED33.K 133.2,49.91 134.34,49.91 | R219.2 126.39,49.91 128.5,49.91 | LED34.K 117.2,49.91 116.43,49.91 | R216.2 110.52,49.91 112.37,49.91 | LED35.K 101.19,49.91 102.21,49.91 | R214.2 94.26,49.91 95.73,49.91 | LED36.K 85.19,49.91 84.56,49.91 | R212.2 78.38,49.91 79.98,49.91 | LED37.K 69.19,49.91 70.08,49.91 | R210.2 62.13,49.91 63.73,49.91
  Bottom 0.762: R209.2 55.14,49.91 56.49,49.91 | 57.38,49.91 56.34,49.91 | 46.2,51.56 46.2,49.91 47.09,49.91 | R206.2 39.01,49.91 40.36,49.91 | LED39.K 30.2,49.91 31.22,49.91 | R201.2 8.59,51.18 9.37,51.18 | 14.2,51.18 9.37,51.18 | R202.2 10.54,51.18 9.37,51.18 | R232.2 212.98,49.91 214.1,49.91 | R231.2 215.65,49.91 216.51,49.91 | 177.9,49.91 177.04,49.91 | LED30.K 181.2,49.91 180.19,49.91 | R218.2 128.85,49.91 130.15,49.91 | C111.1 54.18,64.62 46.2,56.64 46.2,51.56 | 46.2,51.56 LED38.K | 14.2,51.18 LED40.K | LED40.K 14.2,54.1 15.47,55.37 15.47,62.23 14.71,62.99 14.71,74.42 14.2,74.93 LED27.K | 14.2,50.04 LED40.K | R207.1 56.01,49.91 58.52,49.91 | R225.2 176.99,49.91 178.79,49.91
  Bottom 1.016: IC3.20 218.36,1.27 200.63,1.27 | 122.78,1.27 53.57,1.27 1.5,1.27 1.5,95.76 LED17.K 22.58,95.76 | 122.78,1.27 133.32,1.27 136.75,1.27 | 136.75,1.27 198.09,1.27 | 198.09,1.27 200.63,1.27 | 198.09,1.27 J3.7 | 200.63,1.27 J3.8 | 143.74,88.39 C112.1 | J4.2 C31.- C11.- C32.- | R105.1 C33.2 arc42 177.52,163.83 VR2.1 | 189.97,154.43 IC12.7 | 189.97,154.43 D26.C | R140.2 Q35.3 | R109.2 arc-90 52.81,130.05 C37.- | R109.2 arc-65 C22.- | R109.2 R108.1 | C16.- 81.38,134.37 arc43 79.35,137.54 R94.1 | 96.11,131.32 Q9.2 97.26,131.32 arc-90 R64.2 | IC15B.5 40.11,117.65 IC15A.5 | R144.2 Q37.3 | 189.97,154.43 189.97,152.91 arc-90 188.57,151.51 187.17,151.51 arc90 184.76,149.1 arc-90 184.73,149.12 D30.A | Q39.2 205.71,160.53 Q39.3 | C41.2 45.39,164.54 arc90 45.31,164.47 arc90 45.75,164.03 R130.2 | R130.2 arc90 49.5,164.08 arc90 53.01,167.59 VR6.2A arc90 53.04,167.89 55.04,167.89 | 47.73,150.37 C42.- | 47.73,150.37 arc-40 41.12,150.75 arc24 35.03,152.02 33.38,152.02 33.02,152.02 arc90 Q3.3 28.04,147.01 28.04,141.83 | 30.71,151.51 arc13 26.39,158.5 arc-48 VR7.1 25.88,168.78 C48.- 25.88,168.66 arc116 22.71,173.74 20.04,173.74 arc90 J5.2 | 47.73,150.37 arc90 52.43,155.07 52.43,156.97 52.46,156.97 arc-90 VR6.M1 arc90 52.55,156.96 52.55,161.04 arc90 R130.2 | 55.04,167.89 55.09,167.89 | 55.04,167.89 arc-90 VR6.1A 55.01,167.97 arc90 54.97,168.02 arc90 57.38,165.61 60.7,165.61 arc90 VR6.3A | IC14.5 13.74,146.99 arc-90 11.91,145.16 arc99 10.39,143.38 C45.2 10.34,138.99 arc90 11.15,138.18 arc-90 11.13,138.2 R160.1 11.05,138.28 arc-90 11.02,138.3 arc90 11.25,138.07 C52.- 15.54,138.05 | 17.5,166.5 C49.- 17.63,166.5
  Bottom 1.016: J5.2 arc90 14.83,173.86 9.25,173.86 arc90 3.51,168.12 R135.1 3.53,162.81 arc90 4.01,162.33 D32.A | J7.2 6.58,103.12 arc-35 7.59,104.52 arc54 8.48,106.3 R165.2 8.36,106.93 arc13 7.34,109.35 arc-78 8.23,114.55 C53.- | 21.95,134.24 arc90 18.11,138.07 18.08,138.05 15.54,138.05 | VR8.1 21.18,128.14 arc14 21.95,134.24 | 21.95,134.24 arc-76 24.36,136.78 arc53 26.01,137.92 Q4.3 28.04,141.83 | 28.04,141.83 28.04,141.73 | 17.63,166.5 17.63,166.37 | J5.2 17.63,171.2 17.63,166.5 | Q30.3 191.74,126.62 arc90 191.62,126.75 arc-90 191.9,126.47 | 191.9,126.47 Q29.3 192.89,124.61 192.89,124.46 arc-90 192.51,124.08 R60.1 | 191.9,126.47 arc-90 188.95,129.41 188.95,131.57 arc-90 192.38,135 193.4,135 arc90 C35.2 | C62.- C55.- arc75 226.29,157.99 R145.1 | 226.03,152.4 R151.1 | 136.75,1.27 134.85,1.27 IC1.7 132.05,6.6 132.05,11.3 | 132.05,11.3 132.05,11.68 IC1.5 | IC1.4 132.05,14.22 132.05,11.3 | C105.- 124.18,1.27 122.78,1.27 | IC17.15 89,22.35 89,12.83 94.72,7.11 IC18.8 | IC9.8 158.6,112.52 arc-47 159.61,114.94 arc-42 181.71,124.08 arc-3 188.44,124.08 R60.1 | 15.54,138.05 15.47,138.05 | 37.82,151.76 C36.2 | C29.- 46.58,116.2 arc38 48.62,113.54 arc-52 C30.- | R60.1 188.32,124.08
  pour Top (isolate 0.508): 237.72,0 237.72,111.76 232.64,111.76 228.7,111.76 223.88,116.59 222.99,117.47 222.99,123.7 222.99,126.36 218.92,130.43 217.91,131.44 217.91,136.65 217.91,137.67 212.06,137.67 210.79,137.67 210.79,135.38 204.57,135.38 203.17,133.99 203.17,129.29 208.51,123.95 208.51,116.59 204.44,116.59 161.01,116.59 161.01,111.25 161.01,107.95 141.07,107.95 131.29,107.95 127.86,111.38 109.58,111.38 104.24,106.05 104.24,98.17 94.97,98.17 35.41,98.17 35.41,99.95 35.41,102.23 24.1,102.23 22.33,102.23 22.33,96.27 0.23,96.27 0.23,93.47 0.23,0
  pour Top (isolate 0.508): 0.23,180.34 237.72,180.34 237.72,112.52 231.11,112.52 arc-90 223.88,119.76 223.88,129.41 arc90 213.46,139.83 210.79,139.83 arc90 201.52,130.56 arc44 203.3,126.11 arc-134 199.62,117.6 162.79,117.6 arc90 159.36,114.17 159.36,110.24 arc-90 158.22,109.09 132.56,109.09 arc-56 130.4,110.24 arc50 127.23,112.14 114.66,112.14 108.43,110.87 arc2 101.7,109.35 92.56,101.73 85.7,100.08 45.06,100.08 41.38,103.76 23.09,103.76 arc90 20.55,101.22 arc-90 16.87,97.54 4.29,97.54 0.23,97.54
LED_LATCH  (via drill 0.6)
  Top 0.508: 23.83,82.37 23.75,82.37 | 23.83,82.37 IC8.12 | 182.6,76.68 IC4.12 | 138.38,75.34 138.28,75.34 | 138.38,75.34 IC5.12 | 138.38,75.34 143.48,75.34 143.48,84.78 150.9,84.78 154.66,81.03 178.26,81.03 182.6,76.68 | 138.38,75.34 133.81,75.34 132.82,74.35 86.13,74.35 84.71,72.92 72.42,72.92 | 72.42,72.92 61.57,72.92 61.57,76.07 57.38,80.26 39.85,80.26 35.28,84.84 35.28,89.41 32.99,91.69 28.68,91.69 28.68,82.37 23.83,82.37 | 182.6,76.68 182.6,76.71 | 182.6,76.68 182.6,60.96 183.87,59.69 194.79,59.69 197.59,62.48 208,62.48 208,53.59 197.33,53.59 197.33,43.69 190.42,36.78 IC3.32 | v73.3,72.82 73.38,72.9 73.36,72.92 72.42,72.92
  Bottom 0.508: 73.41,72.82 v73.3,72.82 73.38,72.9 | IC7.12 73.25,72.97 73.41,72.82 | IC6.12 77.44,68.58 77.44,68.78 73.41,72.82
MIDI_IN
  Bottom 1.016: IC3.10 193.01,10.08 J3.5
MIDI_OUT
  Bottom 1.016: 195.55,10.08 195.55,10.41 | 195.55,10.08 IC3.11 | J3.6 195.55,10.08
N$1
  Bottom 1.016: IC14.2 5.69,144.27 arc46 6.83,140.46 C51.-
N$2
  Bottom 1.016: R159.1 2.39,138.56 C51.+
N$3
  Bottom 1.016: C50.+ arc90 3.53,151.92 3.53,151.89 4.93,151.89 arc-90 IC14.3
N$4
  Bottom 1.016: 3.53,157.76 3.53,157.86 | 3.53,157.76 arc-90 R135.2 | C50.- arc-90 3.53,154.51 3.53,157.76
N$5
  Bottom 1.016: Q34.3 11.53,120.4 R153.1 11.28,119.89 arc33 10.77,116.71 arc-49 9.5,112.65 arc65 9.25,111.12 R155.2 arc59 10.9,108.08 R156.1
N$6
  Bottom 1.016: C56.+ 3.53,112.14 R161.1
N$7
  Bottom 1.016: 3.53,106.15 C56.- | 3.53,101.47 J7.1 3.53,106.15 | 3.53,106.15 R165.1
N$8
  Bottom 1.016: IC14.4 9.88,146.18 arc-36 7.47,144.27 C47.1
N$9
  Bottom 1.016: C47.2 3.84,144.35 arc-90 3.91,144.27 arc-90 3.58,144.6 IC14.1
N$10
  Bottom 1.016: C43.- 14.58,161.29 14.96,161.67 J5.1
N$11
  Bottom 1.016: C45.1 18.01,143.26 | 18.01,143.26 arc-35 16.61,146.05 IC14.6 arc6 14.58,156.34 C43.+ 8.05,156.16 arc90 7.21,155.32 D32.C 7.21,155.19 arc90 10.77,151.64 D33.A | C44.- 21.44,139.32 18.01,143.26
N$12
  Bottom 0.508: 4.55,130.3 4.67,130.3 5.05,132.08
  Bottom 1.016: R160.2 11.15,133.2 11.15,133.22 7.59,133.22 arc92 4.55,130.3 Q33.2 4.55,122.3 | 5.05,132.08 R159.2 | R161.2 arc90 2.64,120.4 arc90 4.55,122.3 | R153.2 6.43,120.42 arc-90 4.55,122.3
N$13
  Bottom 1.016: C44.+ 24.03,139.37 arc90 23.98,139.32 arc90 24.82,140.16 C46.2 24.82,144.45 arc90 23.72,145.54 arc-96 21.31,148.21 IC14.8
N$14
  Bottom 1.016: Q34.2 12.55,128.65 arc-33 9.25,127.76 R154.1 arc-103 7.09,130.43 R158.1
N$15
  Bottom 1.016: 1.96,130.56 1.88,130.56 | 1.96,130.56 R158.2 | Q33.1 2.01,130.56 1.96,130.56
N$16
  Bottom 1.016: C53.+ 9.25,122.81 R154.2 9.19,122.89 | R136.2 arc90 11.28,124.97 arc90 9.19,122.89 | Q33.3 7.09,125.48 arc-90 9.19,123.37 9.19,122.89
N$17
  Bottom 1.016: Q34.1 14.73,132.36 arc-90 14.71,132.33 arc-90 17.02,134.65 | 17.02,134.65 R157.1 | 17.02,134.65 16.99,134.62 16.74,134.62 16.48,134.62 arc-90 C52.+
N$18
  Bottom 1.016: C59.+ 19.02,109.98 R155.1
N$19
  Bottom 1.016: R156.2 15.98,108.33 arc90 15.52,107.87 C58.+
N$20
  Bottom 1.016: C58.- 15.52,102.31 arc90 15.47,102.36 arc-90 14.71,101.6 J7.3
N$21
  Bottom 1.016: R122.2 C20.1
N$22
  Bottom 1.016: C37.+ arc18 R126.2 R124.2 arc90 54.94,139.09 R125.1
N$23
  Bottom 0.508: R252.2 106.53,88.88 102.51,84.86 IC7.1
N$24
  Top 1.016: IC15B.2 34.82,125.27 arc90 34.77,125.22 IC15A.2
  Bottom 1.016: IC15A.2 arc90 43.15,128.27 43.15,137.79 arc-90 44.55,139.19 arc90 R125.2
N$25
  Bottom 1.016: R121.1 72.75,145.29 arc-90 72.87,145.41 C21.1
N$26
  Bottom 1.016: VR4.2A 112.75,166.37 arc18 104.5,151.64 | C15.- 104.5,151.64 | 104.5,151.64 arc-90 102.21,149.35 C20.2
N$27
  Bottom 0.508: C14.- arc-279 97.51,146.91 100.56,145.54 arc31 102.97,145.16 arc72 116.05,156.97 arc-47 120.75,163.58 arc45 123.93,167.89 VR4.3A 123.98,167.46
  Bottom 1.016: C14.- 82.17,146.96 arc90 C21.2
N$28
  Bottom 1.016: IC15A.7 IC15A.6 40.11,115.11 IC15B.6 34.9,115.11 34.9,112.57 | 34.9,112.57 34.9,112.52 32.99,112.52 arc90 31.34,110.87 arc90 31.32,110.85 R127.1 31.32,112.29 30.33,113.28 R128.2 | 34.9,112.57 IC15B.7
N$29
  Bottom 1.016: IC15B.4 34.87,120.17 arc90 34.9,120.14 arc-90 30.61,124.44 Q1.2
N$30
  Bottom 1.016: R129.1 22.45,108.2 R127.2
N$31
  Top 1.016: 16,115.57 15.98,115.57 | C40.+ arc-90 16,115.57 | R129.2 arc90 20.12,115.57 16,115.57
  Bottom 1.016: R129.2 22.2,113.28 R128.1 | R162.2 18.9,128.4 arc48 19.79,125.35 arc-27 21.82,121.28 arc-118 15.98,115.7 C40.+
N$32
  Bottom 1.016: VR8.3 25.76,126.11 arc39 27.03,115.57 arc-52 27.15,107.06 C38.-
N$33
  Bottom 1.016: D27.A 38.07,148.97 R120.1
N$34
  Bottom 1.016: R119.1 arc90 38.2,160.48 38.2,158.34 arc-90 C36.1 38.33,157.61 arc54 39.47,156.21 arc-76 41.12,153.16 R120.2
N$35
  Bottom 1.016: VR7.2 27.53,163.83 arc90 30.2,161.16 R119.2 33.88,161.04 arc-107 35.28,166.75 arc-14 49.38,170.69 D24.A
N$36
  Bottom 1.016: 228.57,144.02 224.51,144.02 arc-90 C55.+ | 228.57,144.02 Q38.3 | R150.2 arc-90 226.29,144.02 228.57,144.02
N$37
  Bottom 1.016: R142.1 225.4,130.94 arc90 224.89,130.43 R143.2 | R142.1 225.15,130.81 | Q36.1 arc-90 228.19,130.81 R142.1 | R142.1 arc90 224,132.21 C72.-
N$39
  Bottom 1.016: Q36.2 232.51,133.86 arc90 236.45,137.79 236.45,160.27 | 236.45,160.27 236.45,171.07 | R145.2 236.45,158.12 236.45,160.27 | 236.45,171.07 arc90 228.45,178.94 44.55,178.94 arc90 35.66,170.18 D35.A | 236.45,171.07 236.45,171.45 234.87,171.45 arc-90 D34.A
N$40
  Bottom 1.016: R148.2 arc90 230.23,138.94 Q38.1 224.89,138.94 224.64,139.19 R149.1
N$41
  Bottom 1.016: 229.03,155.07 228.96,155.07 | R152.2 arc-90 229.03,155.07 | D37.C arc90 229.97,155.07 229.03,155.07
N$42
  Bottom 1.016: C54.1 R148.1
N$43
  Bottom 1.016: Q37.2 228.83,124.46 arc-90 229.84,125.48 | 229.84,125.48 R143.1 | C54.2 arc90 231.62,125.48 229.84,125.48
N$44
  Bottom 0.508: 231.37,118.49 231.5,118.24 R144.1
  Bottom 1.016: Q37.1 231.37,118.49 arc90 234.92,114.94 235.05,114.94 235.05,114.91 arc-90 R146.1
N$45
  Top 1.016: D36.A arc-90 46.2,178.94 228.57,178.94 arc-90 236.45,171.07 236.45,151.76 arc-90 231.24,146.56 D37.A
  Bottom 1.016: Q38.2 arc90 231.37,144.15 D37.A 231.24,146.69 R151.2 227.43,146.69
N$46
  Bottom 1.016: Q40.1 C62.+ arc4 216.76,147.32 arc-31 218.67,148.84 arc53 224,155.07 R152.1 arc60 221.97,158.62 R138.2
N$47
  Bottom 1.016: 207.49,142.01 207.49,141.99 | Q40.3 arc-90 207.49,142.01 | Q41.1 arc90 207.49,144.55 207.49,142.01
N$48
  Bottom 1.016: IC15A.8 40.23,109.98 40.23,110.03 IC15B.8 arc60 32.36,108.58 arc-55 29.95,107.06 C38.+
N$49
  Bottom 0.508: R61.1 86.21,142.24 arc23 80.49,143.64 arc-90 79.1,145.03 79.1,157.1 arc-90 85.95,163.96 arc90 VR5.1
N$50
  Bottom 1.016: 189.33,165.61 D29.C | 189.33,165.61 D26.A | R117.2 186.66,162.94 arc-90 189.33,165.61
N$51
  Bottom 1.016: D29.A D28.C
N$52
  Top 1.016: IC12.4 197.61,166.75 | 197.61,166.75 197.61,172.31 arc90 194.03,175.9 67.16,175.9 arc90 59.03,167.77 arc-90 59.01,167.78 VR6.2B | 197.61,166.75 197.59,166.75 197.59,165.61 D28.A
  Bottom 1.016: VR6.2B 58.9,167.89 VR6.3B
N$53
  Bottom 1.016: 205.21,154.43 IC12.1 205.23,154.46 arc-90 205.21,154.43 | 205.21,154.43 Q39.1 | Q41.3 208.41,151.23 arc-90 205.21,154.43 | VR5.3 90.99,166.58 arc-90 98.78,174.37 208.89,174.37 arc-90 219.56,163.7 219.56,153.54 arc-70 217.14,150.11 arc-54 209.14,151.13 Q41.3 | Q41.3 209.02,151.26
N$55
  Bottom 0.508: Q35.1 203.94,126.49
  Bottom 1.016: R141.1 R140.1 arc-46 Q35.1
N$56
  Bottom 1.016: Q32.3 49,155.45 R130.1
N$57
  Bottom 0.508: R139.1 arc55 202.92,140.46 arc-41 202.29,145.03 arc2 202.67,146.94 IC12.13
  Bottom 1.016: Q35.2 201.27,127.64 arc-30 202.92,137.03 R139.1 | IC12.5 arc90 197.79,151.76 199.36,151.76 arc-90 202.67,148.46 202.67,146.94 202.67,146.89 arc90 IC12.13
N$58
  Bottom 1.016: 223.37,167.13 R137.1 223.37,173.3 arc-90 D34.C
N$59
  Bottom 0.508: R254.1 113.13,102.62 109.32,102.62 R255.2 Q5.1
N$60
  Bottom 1.016: R98.1 arc90 78.08,124.84 78.21,124.84 arc-86 R97.1 arc7 81,117.09 Q12.5
N$63